# EAGLE design NSL_CylonVI (EAGLE 5.11)
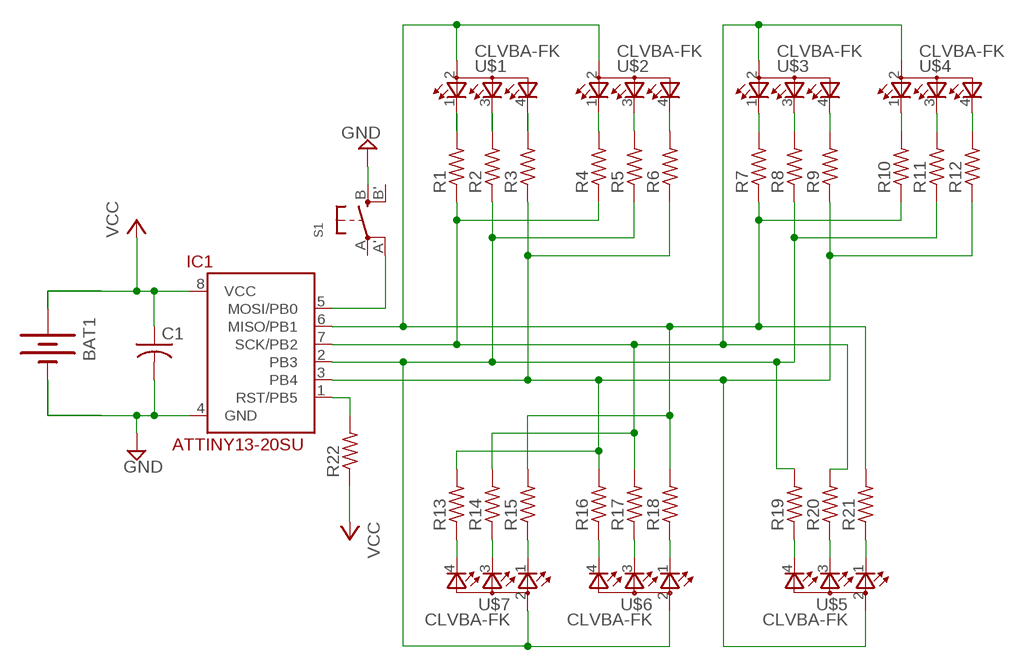
[diagram p0: schematic, sheet 1]

## Parts
BAT1  BATTERY20SMD  [BATTCON_20MM]
C1  C-USC0805  [C0805]
IC1  ATTINY13-20SU  [SOIC8]
R1  R-US_M0805  [M0805]
R2  R-US_M0805  [M0805]
R3  R-US_M0805  [M0805]
R4  R-US_M0805  [M0805]
R5  R-US_M0805  [M0805]
R6  R-US_M0805  [M0805]
R7  R-US_M0805  [M0805]
R8  R-US_M0805  [M0805]
R9  R-US_M0805  [M0805]
R10  R-US_M0805  [M0805]
R11  R-US_M0805  [M0805]
R12  R-US_M0805  [M0805]
R13  R-US_M0805  [M0805]
R14  R-US_M0805  [M0805]
R15  R-US_M0805  [M0805]
R16  R-US_M0805  [M0805]
R17  R-US_M0805  [M0805]
R18  R-US_M0805  [M0805]
R19  R-US_M0805  [M0805]
R20  R-US_M0805  [M0805]
R21  R-US_M0805  [M0805]
R22  R-US_M0805  [M0805]
S1  BUTTON_SMT  [EVQ-Q2]
U$1  CLVBA-FK  [PLCC4]
U$2  CLVBA-FK  [PLCC4]
U$3  CLVBA-FK  [PLCC4]
U$4  CLVBA-FK  [PLCC4]
U$5  CLVBA-FK  [PLCC4]
U$6  CLVBA-FK  [PLCC4]
U$7  CLVBA-FK  [PLCC4]

## Nets
GND: BAT1.2(-) C1.2 IC1.4(GND) S1.B(S)
N$1: R1.2 U$1.1(CRED)
N$2: R2.2 U$1.3(CBLUE)
N$3: R3.2 U$1.4(CGREEN)
N$4: R4.2 U$2.1(CRED)
N$5: R5.2 U$2.3(CBLUE)
N$6: R6.2 U$2.4(CGREEN)
N$7: R7.2 U$3.1(CRED)
N$8: IC1.1(RST/PB5) R22.2
N$10: IC1.6(MISO/PB1) R7.1 R10.1 R15.2 R18.2 R21.2 U$1.2(A2) U$2.2(A2)
N$11: IC1.5(MOSI/PB0) S1.A'(P1)
N$12: R8.2 U$3.3(CBLUE)
N$14: R9.2 U$3.4(CGREEN)
N$15: R10.2 U$4.1(CRED)
N$16: R11.2 U$4.3(CBLUE)
N$17: R12.2 U$4.4(CGREEN)
N$22: IC1.3(PB4) R3.1 R6.1 R9.1 R12.1 R13.2 R16.2 U$5.2(A2)
N$23: IC1.7(SCK/PB2) R1.1 R4.1 R14.2 R17.2 R20.2 U$3.2(A2) U$4.2(A2)
N$25: R13.1 U$7.4(CGREEN)
N$26: R14.1 U$7.3(CBLUE)
N$27: R15.1 U$7.1(CRED)
N$28: R16.1 U$6.4(CGREEN)
N$29: R17.1 U$6.3(CBLUE)
N$30: R18.1 U$6.1(CRED)
N$31: IC1.2(PB3) R2.1 R5.1 R8.1 R11.1 R19.2 U$6.2(A2) U$7.2(A2)
N$32: R19.1 U$5.4(CGREEN)
N$33: R20.1 U$5.3(CBLUE)
N$34: R21.1 U$5.1(CRED)
VCC: BAT1.1(+) C1.1 IC1.8(VCC) R22.1
Unconnected: S1.A(P) S1.B'(S1)

## Library data of the parts
BAT1 = SparkFun:BATTERY: Battery Holders Various common sizes : AA, AAA, 20mm coin cell and 12mm coin cell.
C1 = rcl:C-US: CAPACITOR, American symbol
IC1 = attiny13:ATTINY13-20*
R1-R22 = rcl:R-US_: RESISTOR, American symbol
S1 = microbuilder:BUTTON_SMT: SMT Push Button (6mm) Digikey: P12940SCT-ND
U$1-U$7 = rf_blinky:CLVBA-FK

## Board
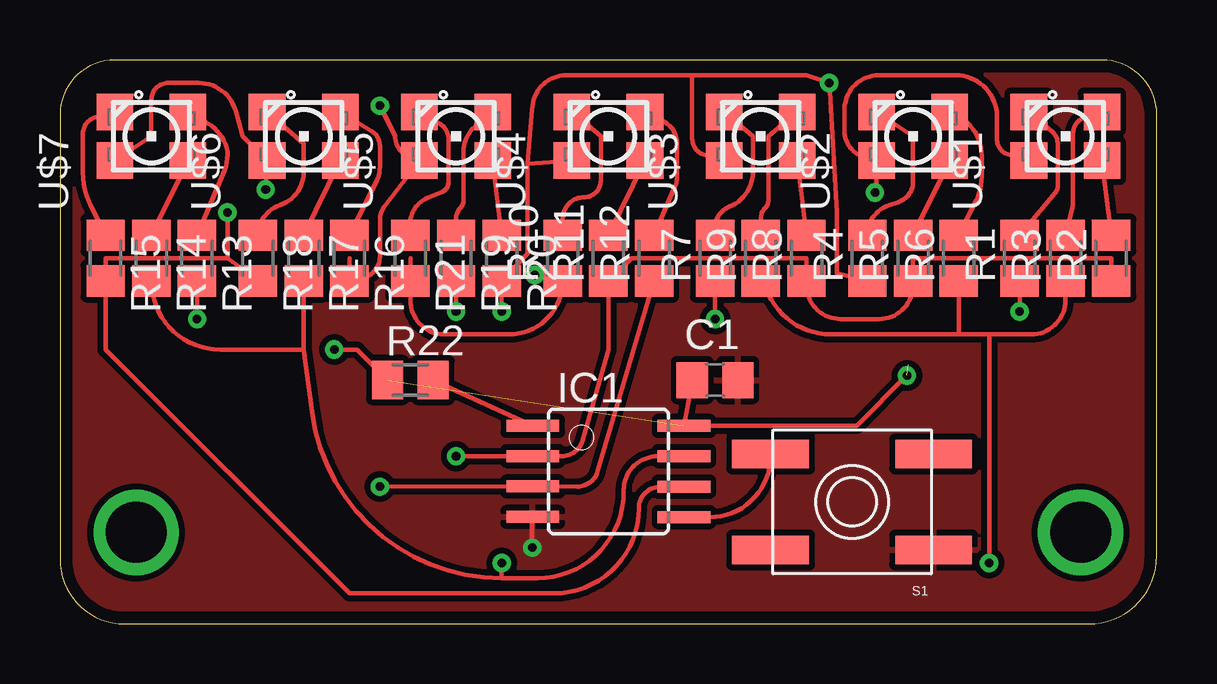
[diagram p1: board, top side]
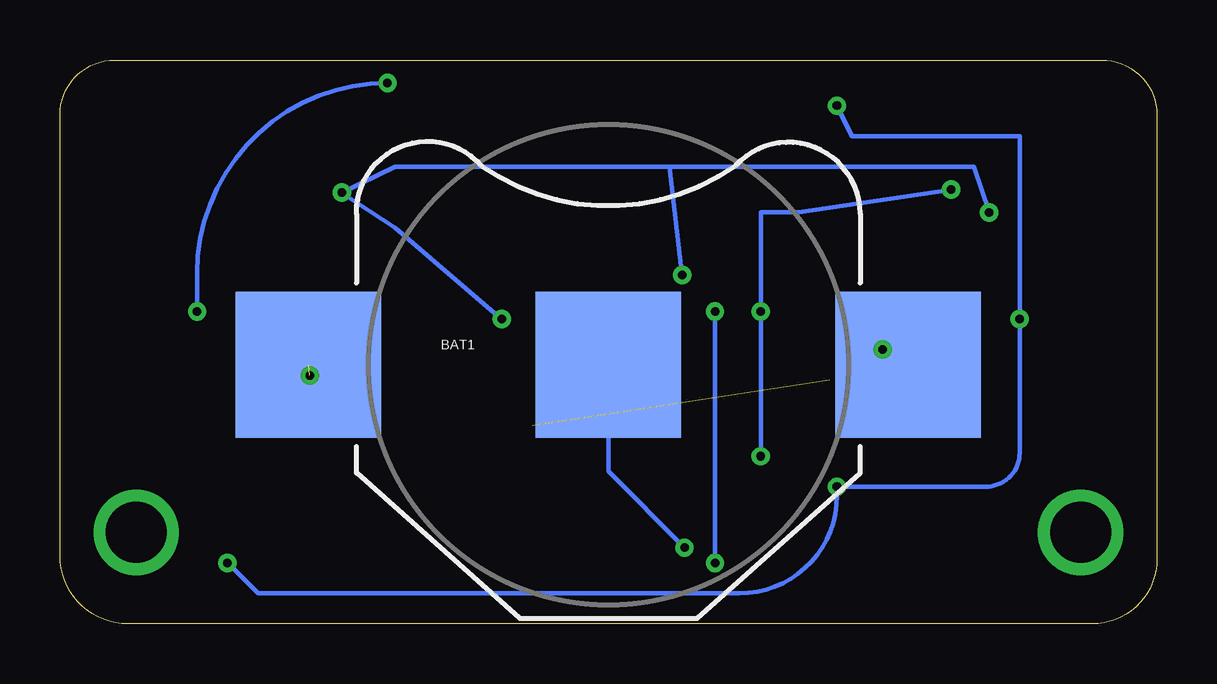
[diagram p2: board, bottom side, seen from below]

Size 45.72 x 23.5 mm. Coordinates in mm from the lower left corner, seen from the top.
Outline: 45.72,21.2 arc90 43.43,23.5 2.29,23.5 arc90 0,21.2 0,2.69 arc90 2.69,0 42.88,0 arc90 45.72,2.84 45.72,21.2
Copper layers (1*16): Top 0.0356mm / dielectric 1.5011mm / Bottom 0.0356mm
Design rules "SilverCircuits *": minimum track width 7mil, minimum drill 14mil, track to track 7mil, track to pad 7mil, pad to pad 7mil, via to via 7mil, smd to smd 0mil, copper to edge 20mil, drill to drill 8mil, minimum pad ring 10mil, minimum via ring 8mil, stop-mask expansion 4mil, vias tented up to drill 0mil, thermal gap 10mil

### Footprints (pad centres in the part's own frame; a part is rotated, then mirrored left to right if it is on the bottom)
BATTCON_20MM = smd 6.07 x 6.07: 1 -12.5,0; 2 0,0; 3 12.5,0
C0805 = smd 1.3 x 1.5: 1 -0.95,0; 2 0.95,0
SOIC8 = smd 0.5 x 2.2: 1 -1.905,-3.154; 2 -0.645,-3.154; 3 0.625,-3.154; 4 1.895,-3.154; 5 1.905,3.154; 6 0.635,3.154; 7 -0.635,3.154; 8 -1.905,3.154
M0805 = smd 1.3 x 1.6: 1 -0.95,0; 2 0.95,0
EVQ-Q2 = smd 3.2 x 1.2: A -3.4,-2; A' 3.4,-2; B -3.4,2; B' 3.4,2
PLCC4 = smd 1.524 x 1.524: 1 -1.524,1.016; 2 -1.524,-1.016; 3 1.524,-1.016; 4 1.524,1.016

### Placement (x,y rotation side)
BAT1  22.86,10.8 0 bottom
C1  27.3,10.16 0 top
IC1  22.86,6.35 270 top
R1  40.01,15.24 90 top
R2  43.81,15.24 90 top
R3  41.91,15.24 90 top
R4  33.66,15.24 90 top
R5  35.56,15.24 90 top
R6  37.47,15.24 90 top
R7  27.3,15.24 90 top
R8  31.12,15.24 90 top
R9  29.21,15.24 90 top
R10  20.95,15.24 90 top
R11  22.86,15.24 90 top
R12  24.77,15.24 90 top
R13  5.71,15.24 270 top
R14  3.81,15.24 270 top
R15  1.91,15.24 270 top
R16  12.07,15.24 270 top
R17  10.16,15.24 270 top
R18  8.25,15.24 270 top
R19  16.51,15.24 270 top
R20  18.41,15.24 270 top
R21  14.61,15.24 270 top
R22  14.61,10.16 0 top
S1  33.02,5.08 180 top
U$1  41.91,20.32 0 top
U$2  35.56,20.32 0 top
U$3  29.21,20.32 0 top
U$4  22.86,20.32 0 top
U$5  16.51,20.32 0 top
U$6  10.16,20.32 0 top
U$7  3.81,20.32 0 top

### Tracks (layer width: path | path; a pad name or v marks a point on that pad's centre or on a via)
GND  (via drill 0.36)
  Top 0.178: IC1.4 19.68,4.43 v19.68,3.18
  Bottom 0.178: v19.68,3.18 22.86,6.35 BAT1.2
  pour Top (isolate 0.254): 45.72,23.5 0,23.5 0,0 45.72,0
N$1
  Top 0.178: R1.2 41.49,17.97 arc40 41.59,18.26 41.59,19.99 arc50 41.34,20.53 U$1.1
N$2
  Top 0.178: R2.2 U$1.3
N$3
  Top 0.178: R3.2 42.21,17.41 arc14 42.23,17.52 42.23,20.44 arc-72 42.72,21.11 U$1.4
N$4
  Top 0.178: U$2.1 35.56,20.32 35.56,18.43 arc-72 34.95,17.58 34.56,17.45 arc72 R4.2
N$5
  Top 0.178: R5.2 U$2.3
N$6
  Top 0.178: R6.2 38.18,17.62 arc27 38.42,18.63 38.42,19.52 arc62 37.42,21.16 U$2.4
N$7
  Top 0.178: U$3.1 28.89,20.32 28.89,18.86 arc-68 27.9,17.38 arc68 27.3,16.51 R7.2
N$8
  Top 0.178: R22.2 IC1.1
N$9  (via drill 2.54)
  other vias: 3.18,3.81
N$10  (via drill 0.36)
  Top 0.178: U$1.2 39.57,19.54 arc-74 39.05,20.22 39.05,21.15 arc90 37.34,22.86 34.13,22.86 arc76 32.75,21.78 32.7,21.59 32.7,20.55 arc74 33.53,19.45 U$2.2 34.04,18.16 v33.97,17.97 | R15.2 1.91,15.24 6.98,15.24 | v27.3,12.7 R7.1 | 14.61,15.24 R21.2 14.61,13.48 arc90 16.02,12.07 18.73,12.07 arc90 R10.1 20.95,14.61 20.89,14.54 v19.79,14.54 | 6.98,15.24 R18.2 | 6.98,15.24 v6.98,17.14 | IC1.6 25.03,5.72 arc90 24.13,4.82 arc-90 20.58,1.27 12.07,1.27 1.91,11.43 R15.2 | R15.2 1.91,14.12
  Bottom 0.178: v27.3,12.7 31.75,16.51 v33.97,17.97 31.75,19.05 20.32,19.05 | v6.98,17.14 7.62,19.05 20.32,19.05 | 20.32,19.05 v19.79,14.54
N$11
  Top 0.178: IC1.5 27.08,4.45 arc90 29.62,6.98 S1.A'
N$12
  Top 0.178: R8.2 U$3.3
N$13  (via drill 2.54)
  other vias: 42.55,3.81
N$14
  Top 0.178: U$3.4 29.53,20.32 29.53,17.65 arc-45 29.4,17.33 arc45 29.21,16.88 R9.2
N$15
  Top 0.178: U$4.1 22.54,20.32 22.54,18.47 arc-90 21.85,17.78 arc90 20.95,16.88 R10.2
N$16
  Top 0.178: R11.2 U$4.3
N$17
  Top 0.178: R12.2 25.64,18.23 arc23 25.72,18.61 25.72,20.03 arc62 25.18,20.92 U$4.4
N$22  (via drill 0.36)
  Top 0.178: 38.73,12.07 37.47,12.07 | 38.73,12.07 40.49,12.07 arc90 41.91,13.48 R3.1 | 37.47,12.07 R6.1 | R12.1 22.42,6.36 arc-73 21.55,5.72 IC1.3 v13.34,5.72 | 37.47,12.07 32.13,12.07 arc-60 29.66,13.5 R9.1 | 12.07,15.24 R16.2 12.65,14.44 arc76 13.34,15.31 13.34,16.84 arc-37 13.52,17.39 U$5.2 14.57,19.46 arc-69 13.97,20.32 v13.34,21.59 | v5.71,12.7 R13.2 | v38.73,2.54 38.73,12.07
  Bottom 0.178: v13.34,21.59 12.7,20.32 5.71,20.32 v5.71,12.7 5.71,7.14 arc90 7.14,5.72 v13.34,5.72 13.34,5.34 arc90 17.4,1.27 37.47,1.27 v38.73,2.54
N$23  (via drill 0.36)
  Top 0.178: 26.35,22.86 26.35,20.22 arc74 26.87,19.54 U$3.2 | 19.49,19.18 19.68,21.44 arc-90 21.1,22.86 26.35,22.86 | 19.49,19.18 U$4.2 | R14.2 arc90 6.67,11.43 10.16,11.43 | 10.16,11.43 R17.2 | 19.49,19.18 19.49,15.43 R20.2 v18.41,13.02 | 26.35,22.86 31.12,22.86 v32.07,22.54 32.38,17.14 32.38,14.61 R4.1 | IC1.7 24.91,6.98 arc90 23.49,5.57 23.49,5.5 arc-90 19.9,1.91 18.41,1.91 | 18.41,1.91 arc-82 10.51,8.83 10.16,11.43 | v40.01,13.02 R1.1 | 18.41,1.91 v18.41,2.54
  Bottom 0.178: v32.07,22.54 arc-90 40.01,14.61 v40.01,13.02 | v18.41,2.54 v18.41,13.02
N$25
  Top 0.178: R13.1 6.73,18.61 arc30 6.98,19.56 6.98,19.68 arc58 5.89,20.99 U$7.4
N$26
  Top 0.178: R14.1 U$7.3
N$27
  Top 0.178: R15.1 1.27,17.46 arc-27 0.95,18.81 0.95,20.42 arc-74 1.47,21.1 U$7.1
N$28
  Top 0.178: R16.1 13.2,18.46 arc27 13.34,19.03 13.34,19.92 arc58 13,20.53 U$6.4
N$29
  Top 0.178: R17.1 U$6.3
N$30
  Top 0.178: U$6.1 10.16,20 10.16,18.83 arc-72 9.16,17.45 arc72 R18.1
N$31  (via drill 0.36)
  Top 0.178: R2.1 43.81,15.24 35.56,15.24 R5.1 35.56,14.12 arc-90 34.14,12.7 32.54,12.7 arc-90 31.12,14.12 R8.1 31.12,15.24 23.81,15.24 R11.1 22.86,11.43 21.78,7.64 arc-75 20.91,6.99 20.32,6.99 | U$7.2 3.81,20.32 3.81,21.83 arc-90 4.52,22.54 5.79,22.54 arc-74 7.31,21.39 7.62,20.32 U$6.2 8.57,18.29 v8.57,18.1 | 20.32,6.99 IC1.2 | v16.51,13.02 R19.2 | v16.51,6.98 16.52,6.99 20.32,6.99
  Bottom 0.178: v16.51,6.98 v16.51,13.02 16.51,17.14 14.92,17.14 v8.57,18.1
N$32
  Top 0.178: R19.1 16.51,16.88 arc-45 16.7,17.33 arc45 16.83,17.65 16.83,19.69 arc-50 17.31,20.72 U$5.4
N$33
  Top 0.178: R20.1 U$5.3
N$34
  Top 0.178: R21.1 14.61,16.69 arc-68 15.32,17.75 15.91,17.98 arc68 16.19,18.4 16.19,20.23 arc60 15.84,20.84 U$5.1
VCC  (via drill 0.36)  (2 unrouted)
  Top 0.178: 26.67,10.16 C1.1 IC1.8 33.21,8.26 v35.31,10.35 | R22.1 12.39,11.43 v11.43,11.43
  Bottom 0.178: v35.31,10.35 35.36,10.16 | v11.43,11.43 12.07,12.07